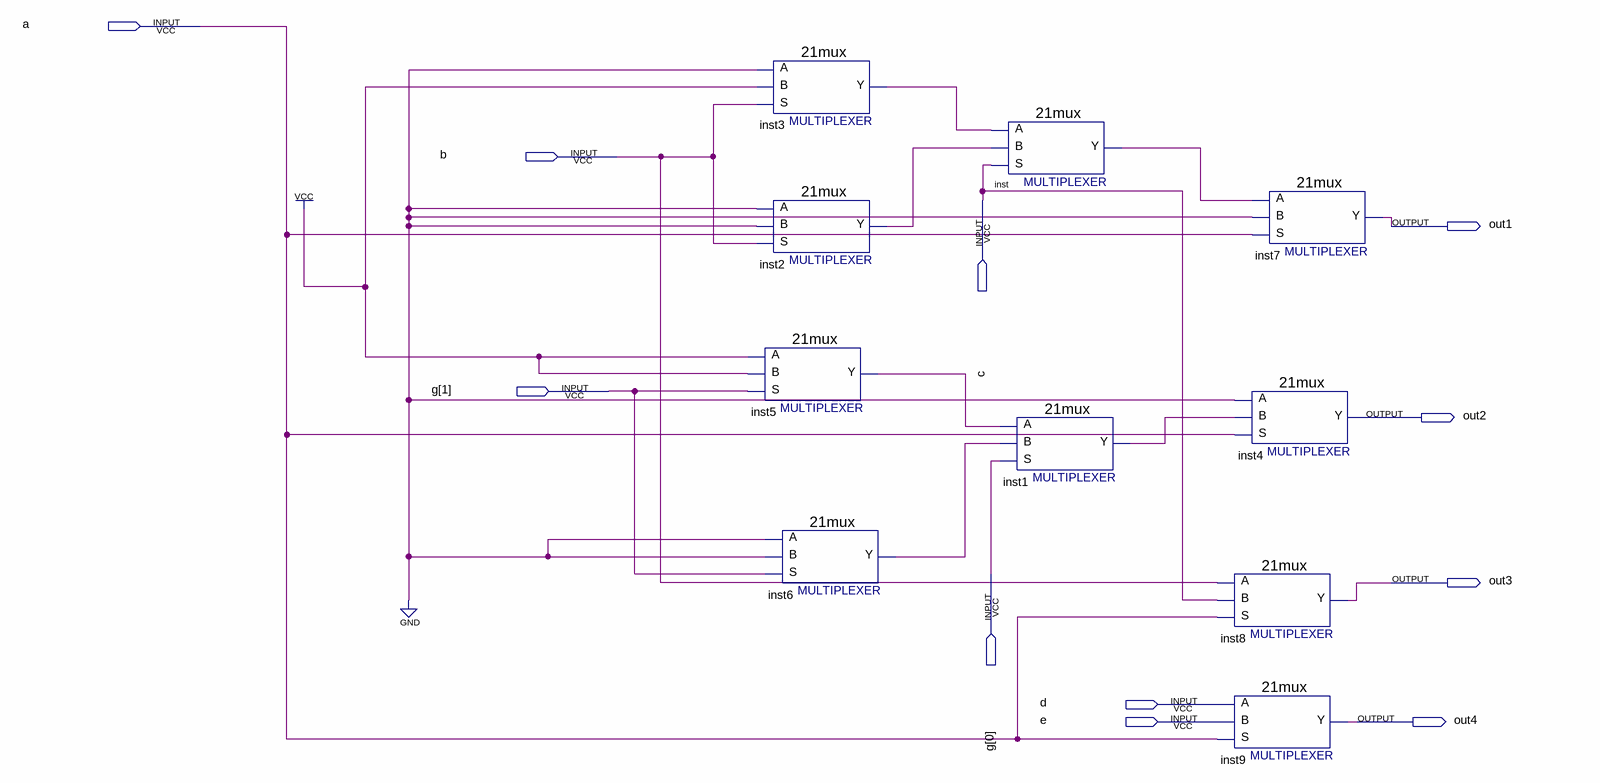
[diagram p0: schematic sheet]
// Quartus schematic verilogToSchematic.bdf as structural Verilog: 10 symbols, 11 pins
module verilogToSchematic (
  input  a,
  input  b,
  input  c,
  input  [1:0] g,
  input  d,
  input  e,
  output out1,
  output out2,
  output out3,
  output out4
);

  wire inst1_y, inst2_y, inst3_y, inst5_y, inst6_y, inst_y;

  \21mux  inst3 (.S(b), .B(1'b1), .A(1'b0), .Y(inst3_y));
  \21mux  inst2 (.S(b), .B(1'b0), .A(1'b0), .Y(inst2_y));
  \21mux  inst5 (.S(g[1]), .B(1'b1), .A(1'b1), .Y(inst5_y));
  \21mux  inst6 (.S(g[1]), .B(1'b0), .A(1'b0), .Y(inst6_y));
  \21mux  inst (.S(c), .B(inst2_y), .A(inst3_y), .Y(inst_y));
  \21mux  inst1 (.S(g[0]), .B(inst6_y), .A(inst5_y), .Y(inst1_y));
  \21mux  inst7 (.S(a), .B(1'b0), .A(inst_y), .Y(out1));
  \21mux  inst4 (.S(a), .B(inst1_y), .A(1'b0), .Y(out2));
  \21mux  inst8 (.S(a), .B(c), .A(b), .Y(out3));
  \21mux  inst9 (.S(a), .B(e), .A(d), .Y(out4));
endmodule
